# EAGLE schematic SquareCount (EAGLE 7.7.0)
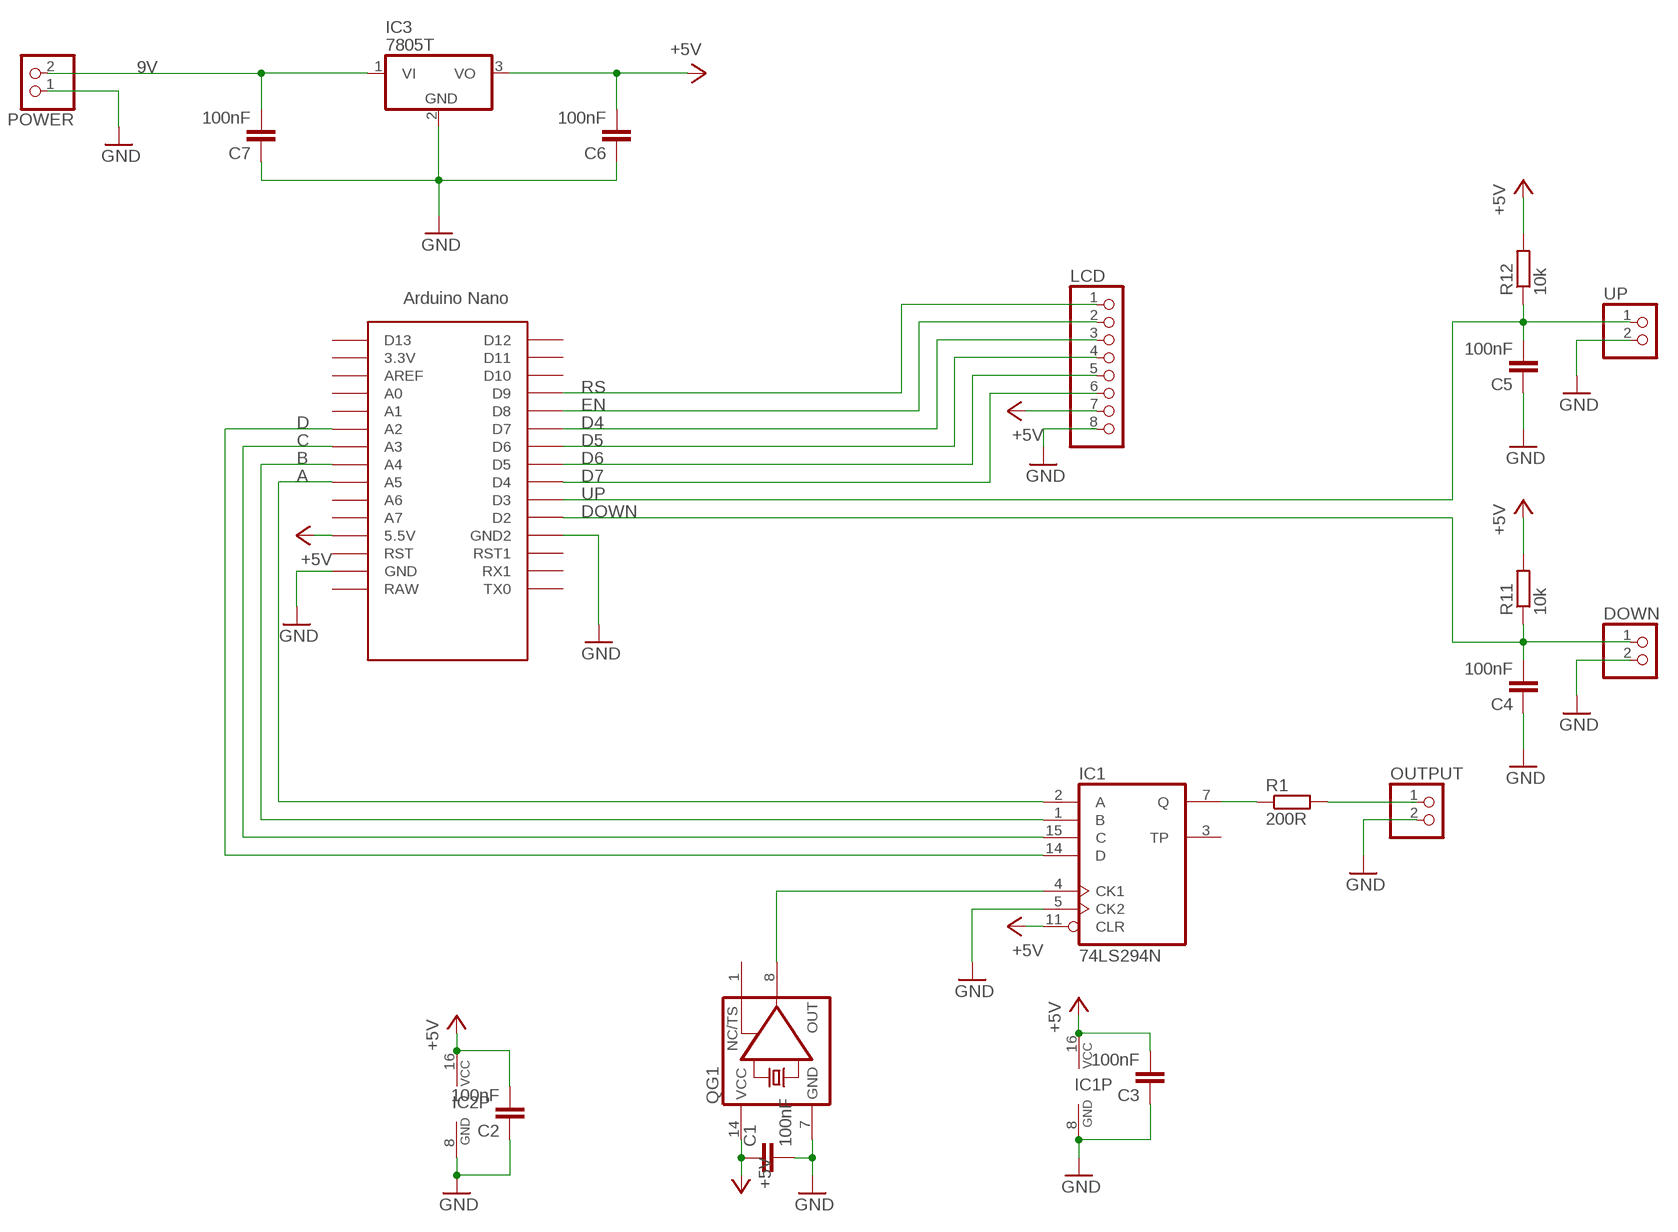
[diagram p0: schematic, sheet 1]

## Parts
C1  100nF  C-EUC0805  [C0805]
C2  100nF  C-EUC0805  [C0805]
C3  100nF  C-EUC0805  [C0805]
C4  100nF  C-EUC0805  [C0805]
C5  100nF  C-EUC0805  [C0805]
C6  100nF  C-EUC0805  [C0805]
C7  100nF  C-EUC0805  [C0805]
DOWN  PINHD-1X2  [1X02]
IC1  74LS294N  [DIL16]
IC2  74HC147N  [DIL16]
IC3  7805T  [TO220H]
LCD  PINHD-1X8  [1X08]
OUTPUT  PINHD-1X2  [1X02]
POWER  PINHD-1X2  [1X02]
QG1  XO-14  [DIL14S]
R1  200R  R-EU_M0805  [M0805]
R11  10k  R-EU_M0805  [M0805]
R12  10k  R-EU_M0805  [M0805]
U$1  NANO  [NANO]
UP  PINHD-1X2  [1X02]

## Nets
9V: C7.2 IC3.1(VI) POWER.2
+5V: C1.1 C2.2 C3.2 C6.2 IC1.11(CLR) IC1.16(VCC) IC2.16(VCC) IC3.3(VO) LCD.7 QG1.14(VCC) R11.2 R12.2 U$1.5V(5.5V)
A: IC1.2(A) U$1.A5
B: IC1.1(B) U$1.A4
C: IC1.15(C) U$1.A3
D: IC1.14(D) U$1.A2
D4: LCD.3 U$1.D7
D5: LCD.4 U$1.D6
D6: LCD.5 U$1.D5
D7: LCD.6 U$1.D4
DOWN: C4.2 DOWN.1 R11.1 U$1.D2
EN: LCD.2 U$1.D8
GND: C1.2 C2.1 C3.1 C4.1 C5.1 C6.1 C7.1 DOWN.2 IC1.5(CK2) IC1.8(GND) IC2.8(GND) IC3.2(GND) LCD.8 OUTPUT.2 POWER.1 QG1.7(GND) U$1.GND U$1.GND1(GND2) UP.2
N$1: IC1.7(Q) R1.1
N$2: OUTPUT.1 R1.2
N$3: IC1.4(CK1) QG1.8(OUT)
RS: LCD.1 U$1.D9
UP: C5.2 R12.1 U$1.D3 UP.1
Unconnected: IC1.3(TP) IC2.1 IC2.2 IC2.3 IC2.4 IC2.5 IC2.6(C) IC2.7(B) IC2.9(A) IC2.10 IC2.11 IC2.12 IC2.13 IC2.14(D) QG1.1(TS) U$1.3.3V U$1.A0 U$1.A1 U$1.A6 U$1.A7 U$1.AREF U$1.D10 U$1.D11 U$1.D12 U$1.D13 U$1.ICSP1 U$1.ICSP2 U$1.ICSP3 U$1.ICSP4 U$1.ICSP5 U$1.ICSP6 U$1.RAW U$1.RST U$1.RST1 U$1.RX1 U$1.TX0

## Library data of the parts
C1-C7 = rcl:C-EU: CAPACITOR, European symbol
DOWN OUTPUT POWER UP = pinhead:PINHD-1X2: PIN HEADER
IC1 = 74xx-eu:74*294: Programmable frequency DIVIDER/DIGITAL TIMER
IC2 = 74xx-eu:74*147: 10-line to 4-line and 8-line to 3-line PRIORITY DECODER
IC3 = linear:78*: Positive VOLTAGE REGULATOR Source: http://cache.national.com/ds/LM/LM78L05.pdf http://www.fairchildsemi.com/ds/LM/LM7805.pdf
LCD = pinhead:PINHD-1X8: PIN HEADER
QG1 = crystal:XO-: CRYSTAL; OC_FARNELL: unknown; OC_NEWARK: unknown
R1 R11 R12 = rcl:R-EU_: RESISTOR, European symbol
U$1 = Arduino-clone:NANO: Arduino Nano